# Altium schematic sheet Humi_IOT.SchDoc
size A4
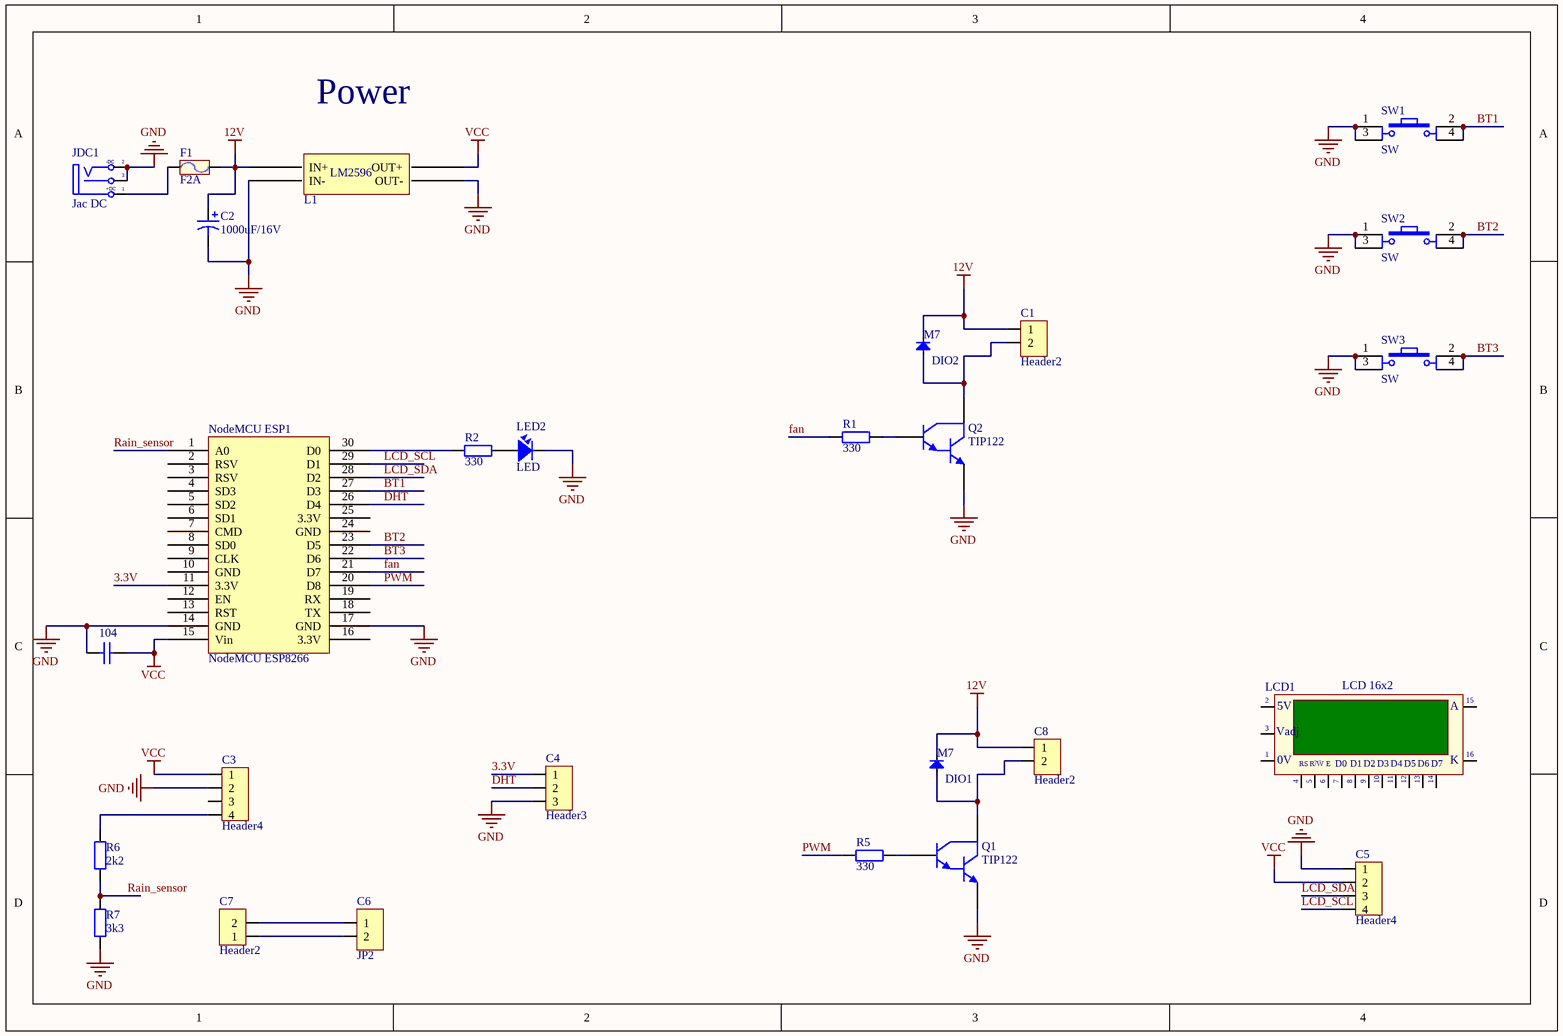
[diagram p0: Humi_IOT.SchDoc]

## Parts
104  Capacitor Ceramic  [C0805]  (value not drawn)
C1  Header2  [Header2]
C2  1000uF/16V  [C10mm]
C3  Header4  [HDR4]
C4  Header3  [Header3]
C5  Header4  [HDR4]
C6  JP2  [JP2-C1T]
C7  Header2  [Header2]
C8  Header2  [Header2]
DIO1  M7  [DIO-SMD-106]
DIO2  M7  [DIO-SMD-106]
F1  F2A  [Fuse]
JDC1  Jac DC  [DC-IN]
L1  BUCK_LM2596  [BUCK_LM2596]  (value not drawn)
LCD1  LCD 16x2  [LCD16X2N]
LED2  LED  [LED-5 GRe]
NodeMCU_ESP1  NodeMCU ESP8266  [NodeMCU ESP8266]
Q1  TIP122  [QTO-220]
Q2  TIP122  [QTO-220]
R1  330  [DIEN TRO 0805]
R2  330  [DIEN TRO 0805]
R5  330  [DIEN TRO 0805]
R6  2k2  [DIEN TRO 0805]
R7  3k3  [DIEN TRO 0805]
SW1  SW  [SW4]
SW2  SW  [SW4]
SW3  SW  [SW4]

## Nets
12V: C1.1 C2.1 C8.1 DIO1.2(K) DIO2.2(K) F1.2 L1.1(IN+)
GND: 104.1 C2.2 C3.2 C4.3 C5.1 JDC1.2(TN) JDC1.3(S) L1.2(IN-) L1.3(OUT-) LED2.2 NodeMCU_ESP1.14(GND) NodeMCU_ESP1.17(GND) Q1.3(E) Q2.3(E) R7.2 SW1.1 SW1.3 SW2.1 SW2.3 SW3.1 SW3.3
VCC: 104.2 C3.1 C5.2 L1.4(OUT+) NodeMCU_ESP1.15(Vin)
3.3V: C4.1 NodeMCU_ESP1.11(3.3V)
BT1: NodeMCU_ESP1.27(D3) SW1.2 SW1.4
BT2: NodeMCU_ESP1.23(D5) SW2.2 SW2.4
BT3: NodeMCU_ESP1.22(D6) SW3.2 SW3.4
DHT: C4.2 NodeMCU_ESP1.26(D4)
fan: NodeMCU_ESP1.21(D7) R1.2
LCD_SCL: C5.4 NodeMCU_ESP1.29(D1)
LCD_SDA: C5.3 NodeMCU_ESP1.28(D2)
PWM: NodeMCU_ESP1.20(D8) R5.2
Rain_sensor: NodeMCU_ESP1.1(A0) R6.2 R7.1
NetC1_2: C1.2 DIO2.1(A) Q2.2(C)
NetC3_4: C3.4 R6.1
NetC6_1: C6.1 C7.2
NetC6_2: C6.2 C7.1
NetC8_2: C8.2 DIO1.1(A) Q1.2(C)
NetF1_1: F1.1 JDC1.1(T)
NetLED2_1: LED2.1 R2.1
NetNodeMCU_ESP1_30: NodeMCU_ESP1.30(D0) R2.2
NetQ1_1: Q1.1(B) R5.1
NetQ2_1: Q2.1(B) R1.1

Not connected (* = marked no-connect by the designer): C3 3; LCD1 1(GND) 2(VDD) 3(VAdj) 4(RS) 5(R/~{W}) 6(~{EN}) 7(D0) 8(D1) 9(D2) 10(D3) 11(D4) 12(D5) 13(D6) 14(D7) 15(A) 16(K); NodeMCU_ESP1 2(RSV) 3(RSV) 4(SD3) 5(SD2) 6(SD1) 7(CMD) 8(SD0) 9(CLK) 10(GND) 12(EN) 13(RST) 16(3.3V) 18(TX) 19(RX) 24(GND) 25(3.3V)

## Notes on the sheet
- Power
- (in symbol BUCK_LM2596) LM2596
- (in symbol DCIN) -DC; +DC
- (in symbol LCD) 5V; Vadj; |; 0V; R/W; E

## Library data of the parts
104 = CapSMD: Capacitor; Value: 33p; Published: 8-Jun-2000; LatestRevisionDate: 17-Jul-2002; LatestRevisionNote: Re-released for DXP Platform.; PackageReference: RAD-0.3; Publisher: Altium Limited
C1 C7 C8 = Header2: Header IDC, 2 x 1 Pin Vertical 2.54mm Pitch (Non-Boxed, Male); Manufacturer: W¨¹rth Elektronik eiSos GmbH; partNo: 613002143121; ComponentLink1 Description: Manufacturer; ComponentLink2 Description: Datasheet; NoPins: 02; Created Date: 29 March 2013; ComponentLink1URL: http://www.we-online.com; ComponentLink2URL: http://katalog.we-online.de/em/datasheet/6130xx143121.pdf; Created by: Karrer Zheng
C2 = Cap Pol 12mm: Polarized Capacitor (Axial); Published: 8-Jun-2000; LatestRevisionDate: 17-Jul-2002; LatestRevisionNote: Re-released for DXP Platform.; PackageReference: POLAR0.8; Publisher: Altium Limited
C3 C5 = Header4: Header IDC, 4 x 1 Pin Vertical 2.54mm Pitch (Non-Boxed, Male); Manufacturer: W¨¹rth Elektronik eiSos GmbH; partNo: 613002143121; ComponentLink1 Description: Manufacturer; ComponentLink2 Description: Datasheet; NoPins: 02; Created Date: 29 March 2013; ComponentLink1URL: http://www.we-online.com; ComponentLink2URL: http://katalog.we-online.de/em/datasheet/6130xx143121.pdf; Created by: Karrer Zheng
C4 = Header3: Header IDC, 3 x 1 Pin Vertical 2.54mm Pitch (Non-Boxed, Male); Manufacturer: W¨¹rth Elektronik eiSos GmbH; partNo: 613002143121; ComponentLink1 Description: Manufacturer; ComponentLink2 Description: Datasheet; NoPins: 02; Created Date: 29 March 2013; ComponentLink1URL: http://www.we-online.com; ComponentLink2URL: http://katalog.we-online.de/em/datasheet/6130xx143121.pdf; Created by: Karrer Zheng
C6 = JP2: WR-PHD 2.54 mm Angled Socket Header; Manufacturer: W¨¹rth Elektronik eiSos GmbH; partNo: 613002143121; ComponentLink1 Description: Manufacturer; ComponentLink2 Description: Datasheet; NoPins: 02; Created Date: 29 March 2013; ComponentLink1URL: http://www.we-online.com; ComponentLink2URL: http://katalog.we-online.de/em/datasheet/6130xx143121.pdf; Created by: Karrer Zheng
DIO1 DIO2 = Diode SMD: Default Diode; Code - JEDEC: DO-214-AB; Value: 1N5007; Published: 8-Jun-2000; Revision: July-2002: Re-released for DXP Platform.; Publisher: Altium Limited
F1 = Fuse: Designed by: VanDungEvn; Value: Fuse
JDC1 = DCIN: Jac DC input; Value: Jac DC
LCD1 = LCD
LED2 = LED: LED Single colour Green and Red; Value: LED 3 ly Single Colour
Q1 Q2 = TIP122: Darlington Silicon Power NPN Transistor, 8 Amp, 100 Volts and 65 Watts
R1 R2 R5-R7 = R0805: Resistor SMD 0805; Published: 8-Jun-2000; LatestRevisionDate: 17-Jul-2002; LatestRevisionNote: Re-released for DXP Platform.; PackageReference: AXIAL-0.4; Publisher: Altium Limited
SW1-SW3 = SW4: Switch button 4 pin; Value: Button chip 4 pin